# Altium schematic sheet Analog_Filter.SchDoc
size 420 x 297 mm; SheetNumber: 3; SheetTotal: 6
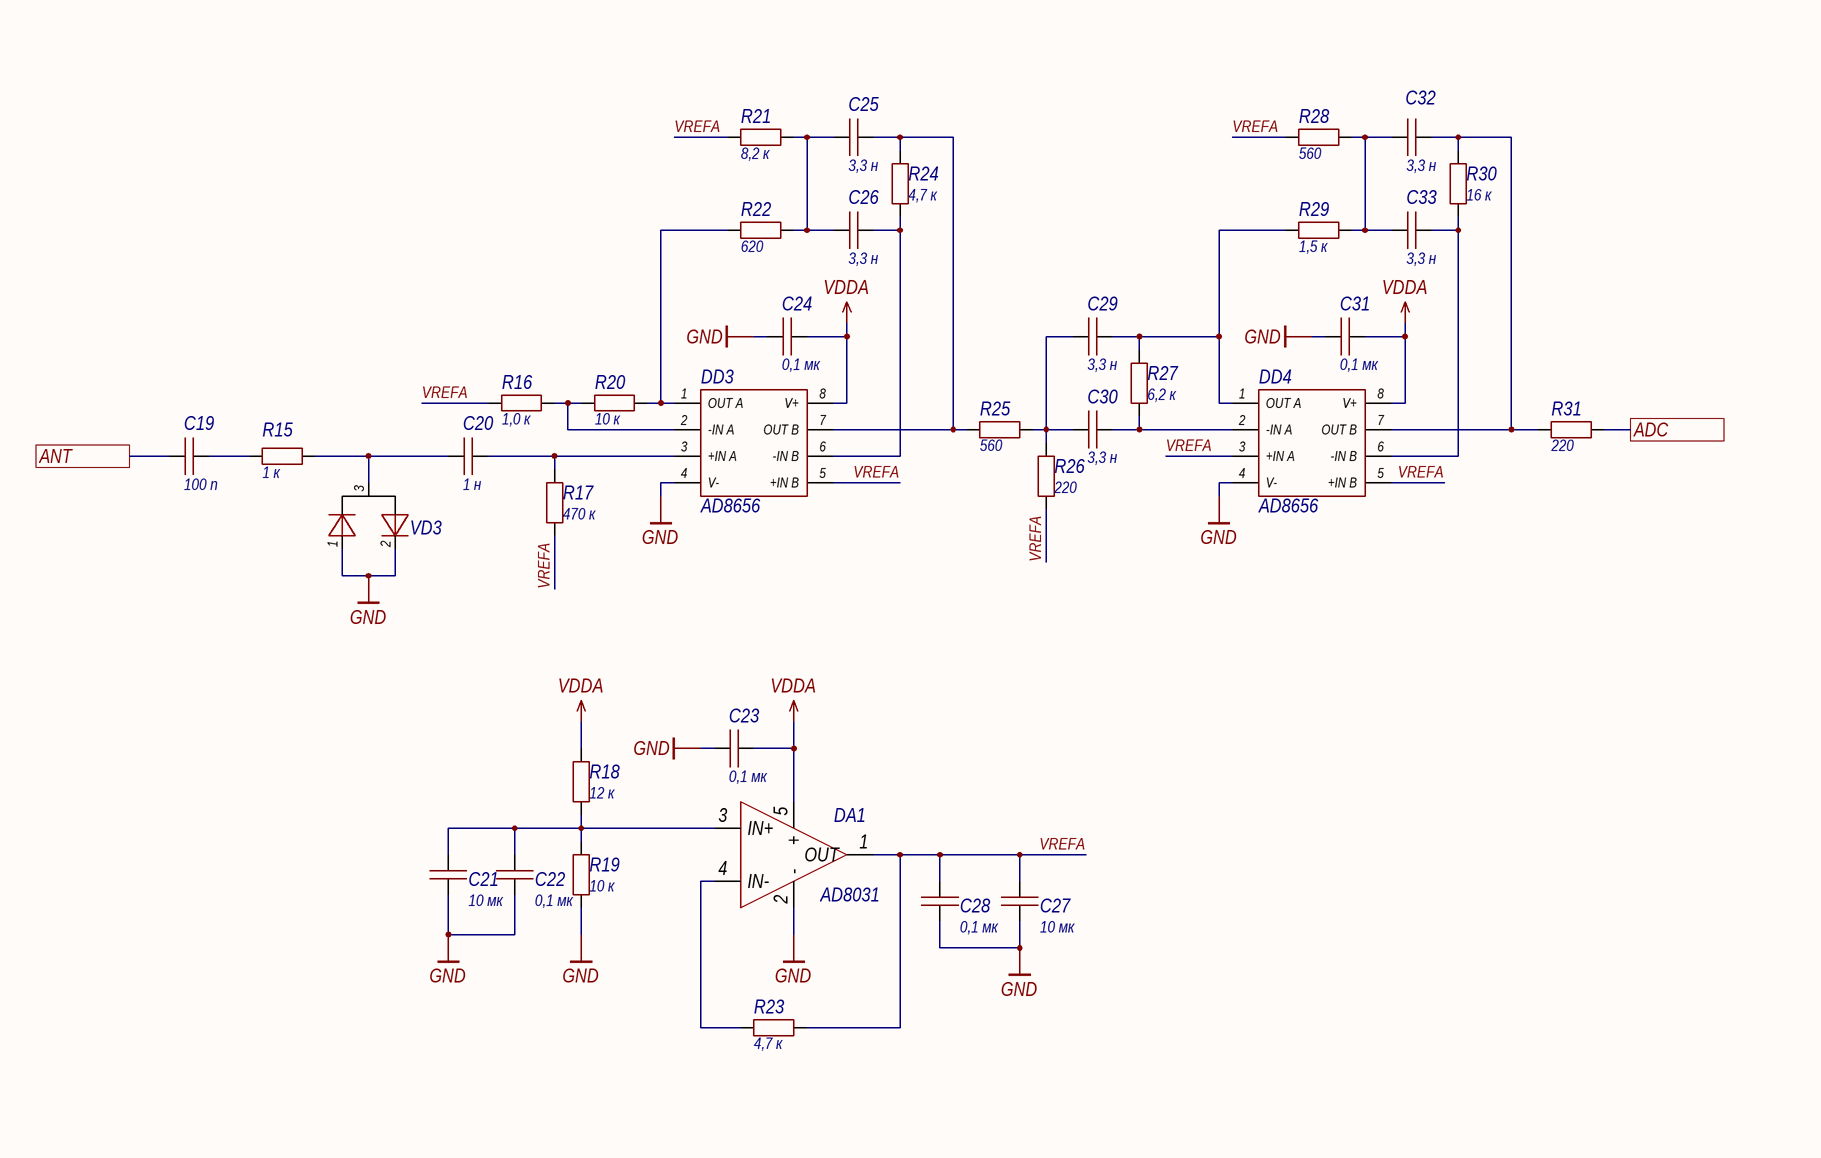
[diagram p0: Analog_Filter.SchDoc, left]
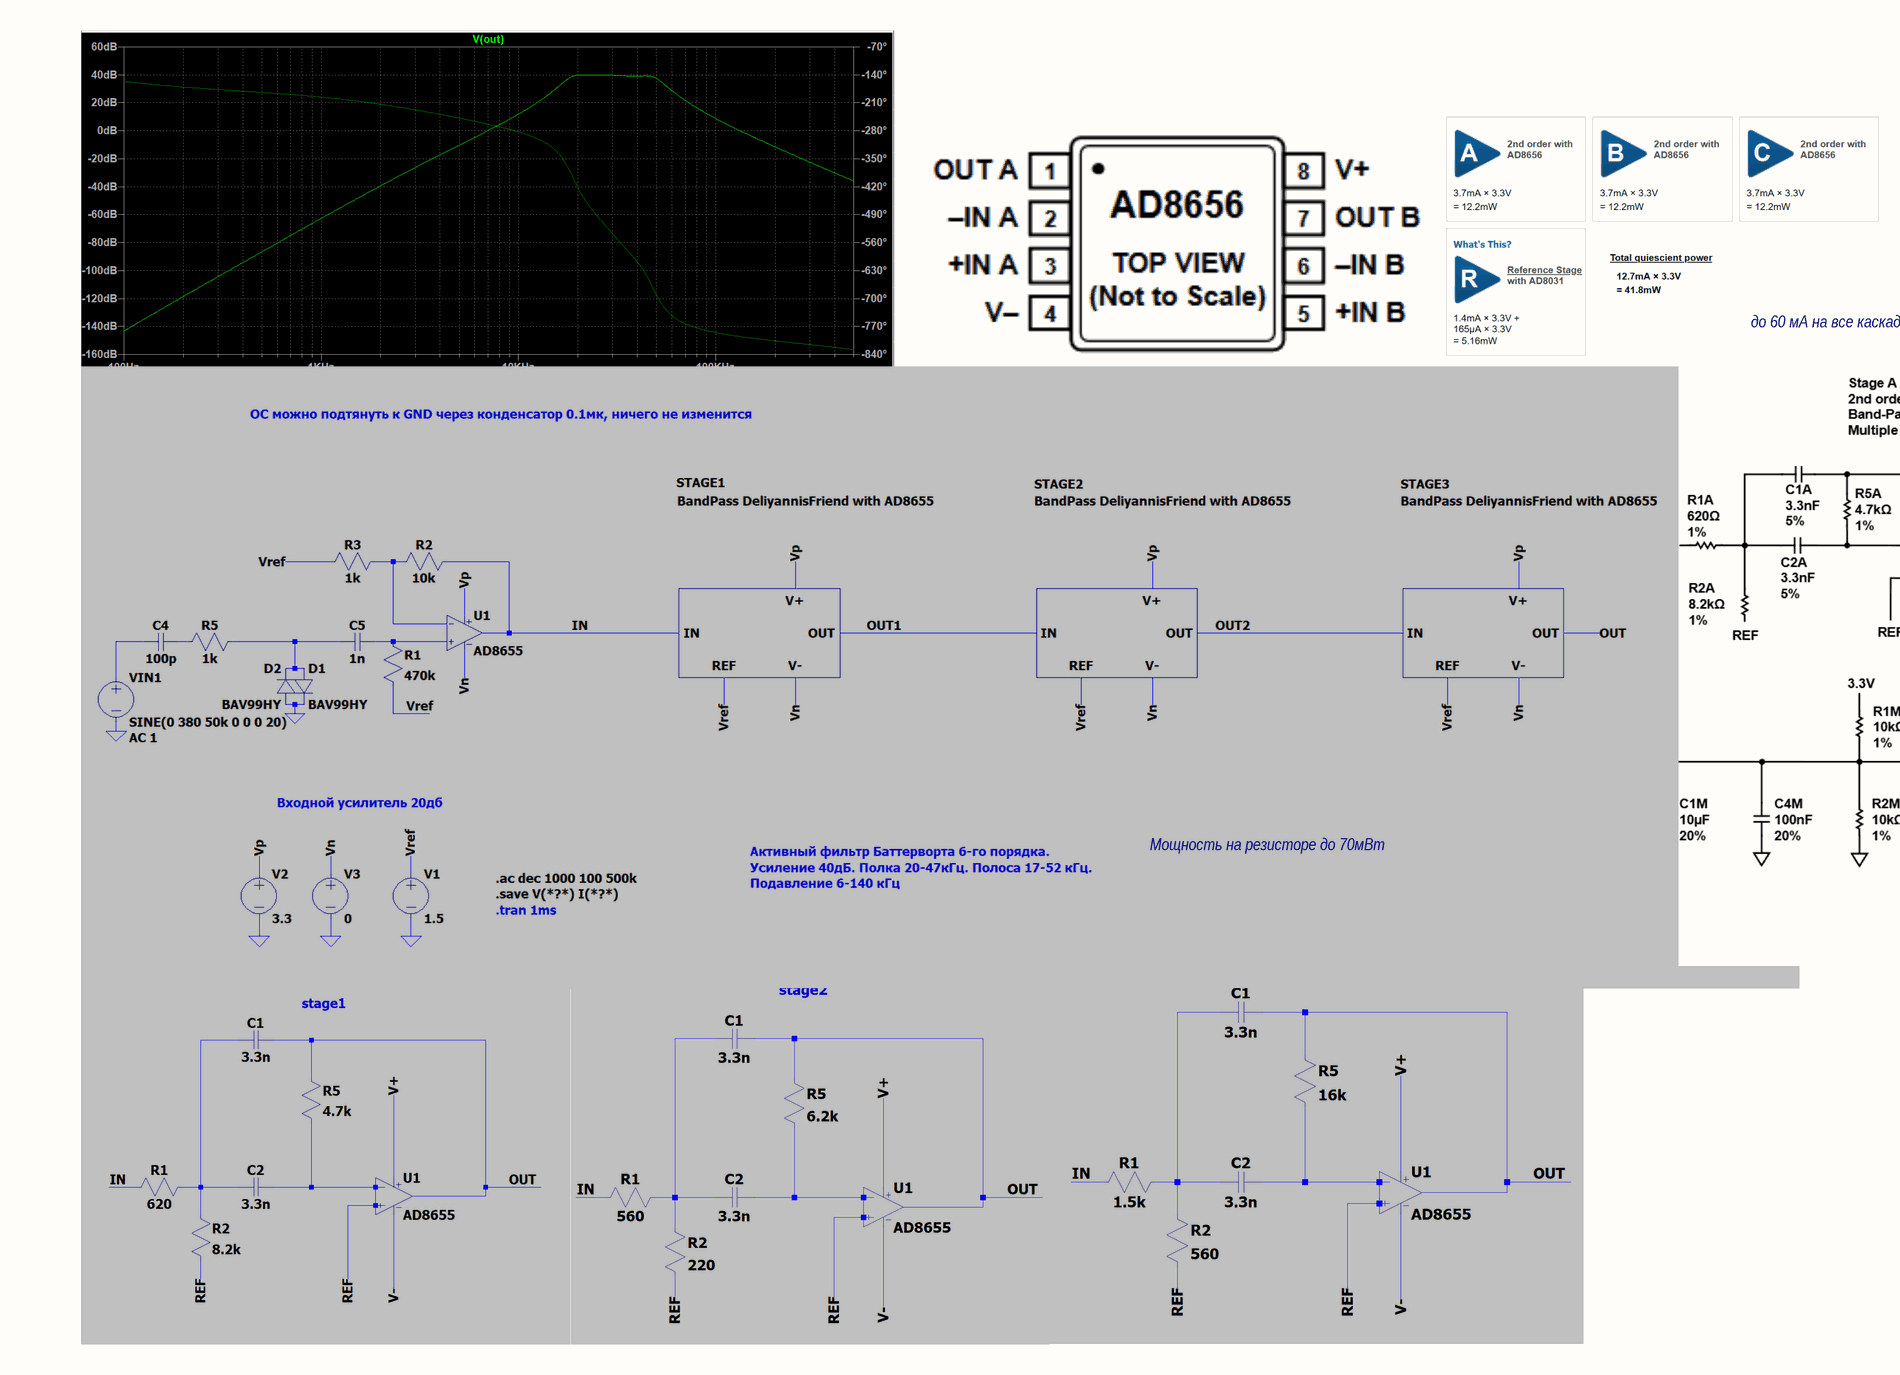
[diagram p1: Analog_Filter.SchDoc, middle]
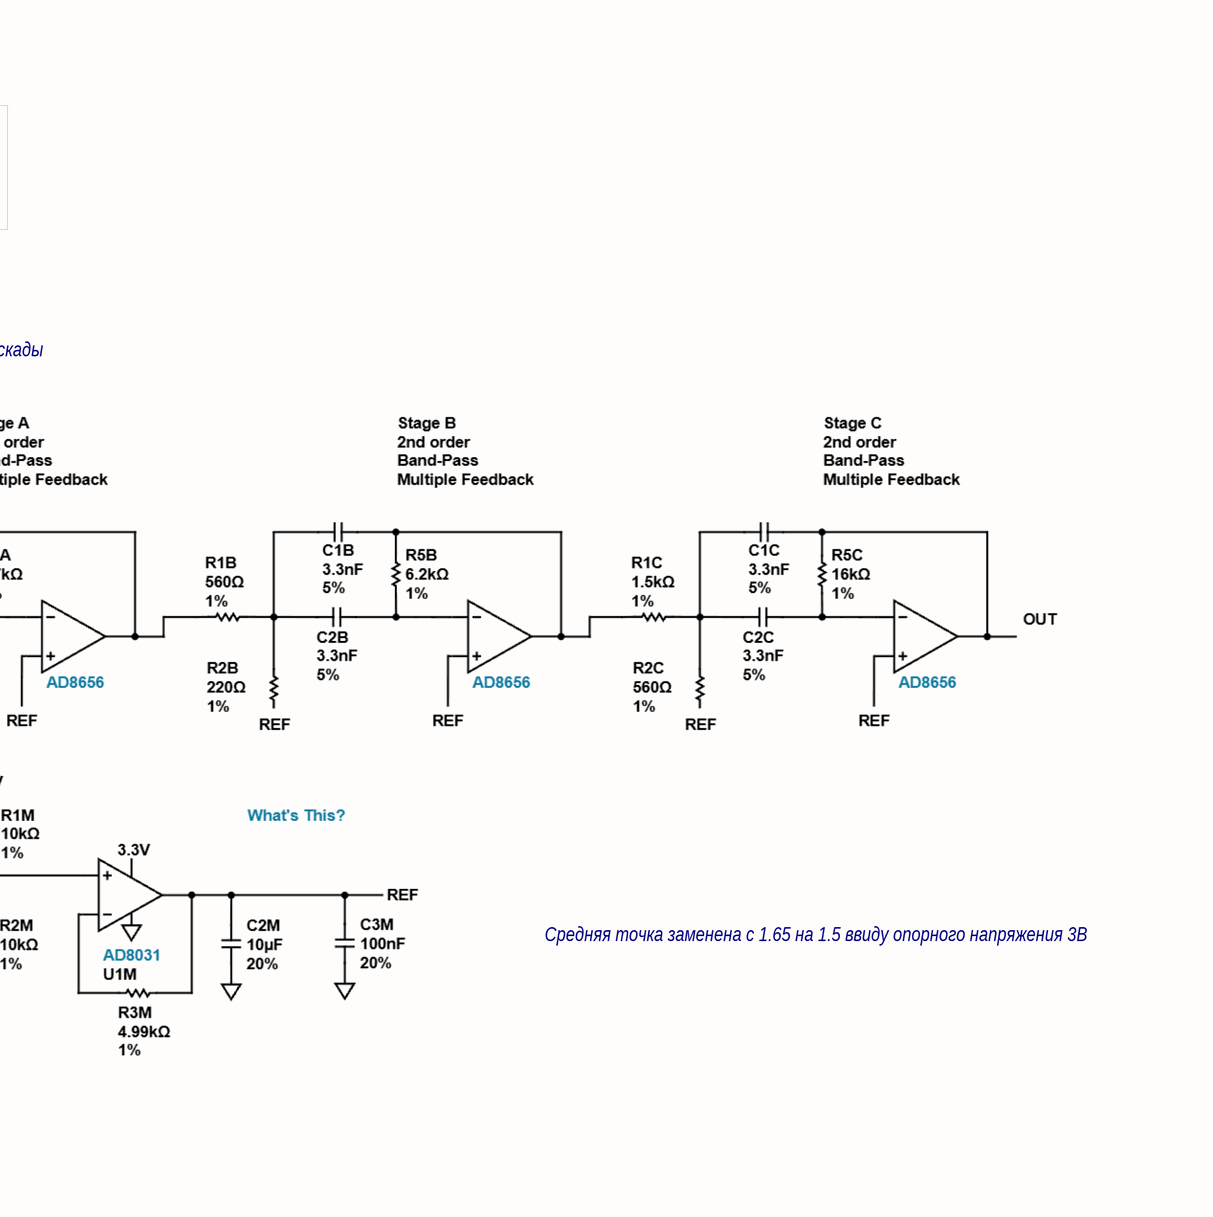
[diagram p2: Analog_Filter.SchDoc, right]

## Parts
C19  value 100 п  [1206C]  (hidden comment: Capacitor)
C20  value 1 н  [0603C]  (hidden comment: Capacitor)
C21  value 10 мк  [0603C]  (hidden comment: Capacitor)
C22  value 0,1 мк  [0603C]  (hidden comment: Capacitor)
C23  value 0,1 мк  [0603C]  (hidden comment: Capacitor)
C24  value 0,1 мк  [0603C]  (hidden comment: Capacitor)
C25  value 3,3 н  [0603C]  (hidden comment: Capacitor)
C26  value 3,3 н  [0603C]  (hidden comment: Capacitor)
C27  value 10 мк  [0603C]  (hidden comment: Capacitor)
C28  value 0,1 мк  [0603C]  (hidden comment: Capacitor)
C29  value 3,3 н  [0603C]  (hidden comment: Capacitor)
C30  value 3,3 н  [0603C]  (hidden comment: Capacitor)
C31  value 0,1 мк  [0603C]  (hidden comment: Capacitor)
C32  value 3,3 н  [0603C]  (hidden comment: Capacitor)
C33  value 3,3 н  [0603C]  (hidden comment: Capacitor)
DA1  AD8031  [SOT23-5]
DD3  AD8656  [SOIC-8]
DD4  AD8656  [SOIC-8]
R15  value 1 к  [0805R]  (hidden comment: Resistor)
R16  value 1,0 к  [0603R]  (hidden comment: Resistor)
R17  value 470 к  [0603R]  (hidden comment: Resistor)
R18  value 12 к  [0603R]  (hidden comment: Resistor)
R19  value 10 к  [0603R]  (hidden comment: Resistor)
R20  value 10 к  [0603R]  (hidden comment: Resistor)
R21  value 8,2 к  [0603R]  (hidden comment: Resistor)
R22  value 620  [0603R]  (hidden comment: Resistor)
R23  value 4,7 к  [0603R]  (hidden comment: Resistor)
R24  value 4,7 к  [0603R]  (hidden comment: Resistor)
R25  value 560  [0603R]  (hidden comment: Resistor)
R26  value 220  [0603R]  (hidden comment: Resistor)
R27  value 6,2 к  [0603R]  (hidden comment: Resistor)
R28  value 560  [0603R]  (hidden comment: Resistor)
R29  value 1,5 к  [0603R]  (hidden comment: Resistor)
R30  value 16 к  [0603R]  (hidden comment: Resistor)
R31  value 220  [0603R]  (hidden comment: Resistor)
VD3  BAV99  [SOT23-3]  (value not drawn)

## Ports
ADC, ANT

## Nets
GND: C21.1 C22.1 C23.1 C24.1 C27.1 C28.1 C31.1 DA1.2(-) DD3.4(V-) DD4.4(V-) R19.1 VD3.1 VD3.2
VDDA: C23.2 C24.2 C31.2 DA1.5(+) DD3.8(V+) DD4.8(V+) R18.2
ADC: R31.2 ; port ADC
ANT: C19.1 ; port ANT
VREFA: C27.2 C28.2 DA1.1(OUT) DD3.5(+IN_B) DD4.3(+IN_A) DD4.5(+IN_B) R16.1 R17.1 R21.2 R23.2 R26.1 R28.1
NetC19_2: C19.2 R15.1
NetC20_1: C20.1 R15.2 VD3.3
NetC20_2: C20.2 DD3.3(+IN_A) R17.2
NetC21_2: C21.2 C22.2 DA1.3(IN+) R18.1 R19.2
NetC25_1: C25.1 C26.1 R21.1 R22.2
NetC25_2: C25.2 DD3.7(OUT_B) R24.1 R25.1
NetC26_2: C26.2 DD3.6(-IN_B) R24.2
NetC29_1: C29.1 C30.1 R25.2 R26.2
NetC29_2: C29.2 DD4.1(OUT_A) R27.2 R29.1
NetC30_2: C30.2 DD4.2(-IN_A) R27.1
NetC32_1: C32.1 C33.1 R28.2 R29.2
NetC32_2: C32.2 DD4.7(OUT_B) R30.2 R31.1
NetC33_2: C33.2 DD4.6(-IN_B) R30.1
NetDA1_4: DA1.4(IN-) R23.1
NetDD3_1: DD3.1(OUT_A) R20.2 R22.1
NetDD3_2: DD3.2(-IN_A) R16.2 R20.1

## Notes on the sheet
- до 60 мА на все каскады
- Мощность на резисторе до 70мВт
- Средняя точка заменена с 1.65 на 1.5 ввиду опорного напряжения 3В
- Перв. примен.
- Справ. №
- Подп. и дата
- Инв. № дубл.
- Взам. инв. №
- Инв. № подл.
- Изм.
- Лист
- № докум.
- Подп.
- Дата
- Копировал
- Формат А3

## Library data of the parts
C19 = Capacitor_100p_5_630V_NP0_1206C: Конденсатор 1206C ёмкостью 100 п 5%, 630 В, NP0; Voltage (V): 630; Capacity (nF): 0,1; Автор: glebmih; Part Number: Capacitor_100p_5_630V_NP0_1206C; Tolerance: 5%; Dielectric: NP0
C20 = Capacitor_1n_5_50V_NP0_0603C: Конденсатор 0603C ёмкостью 1 н 5%, 50 В, NP0; Voltage (V): 50; Capacity (nF): 1; Автор: glebmih; Part Number: Capacitor_1n_5_50V_NP0_0603C; Tolerance: 5%; Dielectric: NP0
C21 C27 = Capacitor_10u_10_10V_X7R_0603C: Конденсатор 0603C ёмкостью 10 мк 10%, 10 В, X7R; Voltage (V): 10; Capacity (nF): 10000; Автор: glebmih; Datasheet: https://static.chipdip.ru/lib/893/DOC031893419.pdf; Part Number: Capacitor_10u_10_10V_X7R_0603C; Tolerance: 10%; Dielectric: X7R
C22-C24 C28 C31 = Capacitor_0,1u_10_50V_X7R_0603C: Конденсатор 0603C ёмкостью 0,1 мк 10%, 50 В, X7R; Voltage (V): 50; Capacity (nF): 100; Part Number: Capacitor_0,1u_10_50V_X7R_0603C; Tolerance: 10%; Dielectric: X7R
C25 C26 C29 C30 C32 C33 = Capacitor_3.3n_5_50V_NP0_0603C: Конденсатор 0603C ёмкостью 3,3 н 5%, 50 В, NP0; Voltage (V): 50; Capacity (nF): 3,3; Автор: glebmih; Part Number: Capacitor_3.3n_5_50V_NP0_0603C; Tolerance: 5%; Dielectric: NP0
DA1 = AD8031: Операционный усилитель, 80МГц, 1-канал, 35В/мкс, Voltage Feedback, Rail-to-Rail; Автор: glebmih; Part Number: AD8031; Datasheet: https://static.chipdip.ru/lib/262/DOC005262075.pdf
DD3 DD4 = AD8656: Операционный усилитель 28МГц, CMOS, 2-канала, Rail-to-Rail; Автор: glebmih; Part Number: AD8656; Datasheet: https://static.chipdip.ru/lib/442/DOC011442004.pdf
R15 = Resistor_1k_0805: Резистор номиналом 1 кОм 1%; Автор: glebmih; Power: *; Part Number: Resistor_1k_0805; Tolerance: 1%
R16 = Resistor_1.0k_1_0603: Резистор номиналом 1,0 кОм 1%; Power: *; Part Number: Resistor_1.0k_1_0603; Tolerance: 1%
R17 = Resistor_470k_1_0603: Резистор номиналом 470 кОм 1%; Power: *; Part Number: Resistor_470k_1_0603; Tolerance: 1%
R18 = Resistor_12k_1_0603: Резистор номиналом 12 кОм 1%; Power: *; Part Number: Resistor_12k_1_0603; Tolerance: 1%
R19 R20 = Resistor_10k_1_0603: Резистор номиналом 10 кОм 1%; Power: *; Part Number: Resistor_10k_1_0603; Tolerance: 1%
R21 = Resistor_8.2k_1_0603: Резистор номиналом 8,2 кОм 1%; Power: *; Part Number: Resistor_8.2k_1_0603; Tolerance: 1%
R22 = Resistor_620_1_0603: Резистор номиналом 620 Ом 1%; Power: *; Part Number: Resistor_620_1_0603; Tolerance: 1%
R23 R24 = Resistor_4.7k_1_0603: Резистор номиналом 4,7 кОм 1%; Power: *; Part Number: Resistor_4.7k_1_0603; Tolerance: 1%
R25 R28 = Resistor_560_1_0603: Резистор номиналом 560 Ом 1%; Power: *; Part Number: Resistor_560_1_0603; Tolerance: 1%
R26 R31 = Resistor_220_1_0603: Резистор номиналом 220 Ом 1%; Power: *; Part Number: Resistor_220_1_0603; Tolerance: 1%
R27 = Resistor_6.2k_1_0603: Резистор номиналом 6,2 кОм 1%; Power: *; Part Number: Resistor_6.2k_1_0603; Tolerance: 1%
R29 = Resistor_1.5k_1_0603: Резистор номиналом 1,5 кОм 1%; Power: *; Part Number: Resistor_1.5k_1_0603; Tolerance: 1%
R30 = Resistor_16k_1_0603: Резистор номиналом 16 кОм 1%; Power: *; Part Number: Resistor_16k_1_0603; Tolerance: 1%
VD3 = BAV99: Диод импульсный, 2 х 0.2А, 70В, последовательное включение; Voltage (V): 70; Current: 0.2; Автор: glebmih; Part Number: BAV99; Datasheet: https://static.chipdip.ru/lib/931/DOC030931559.pdf